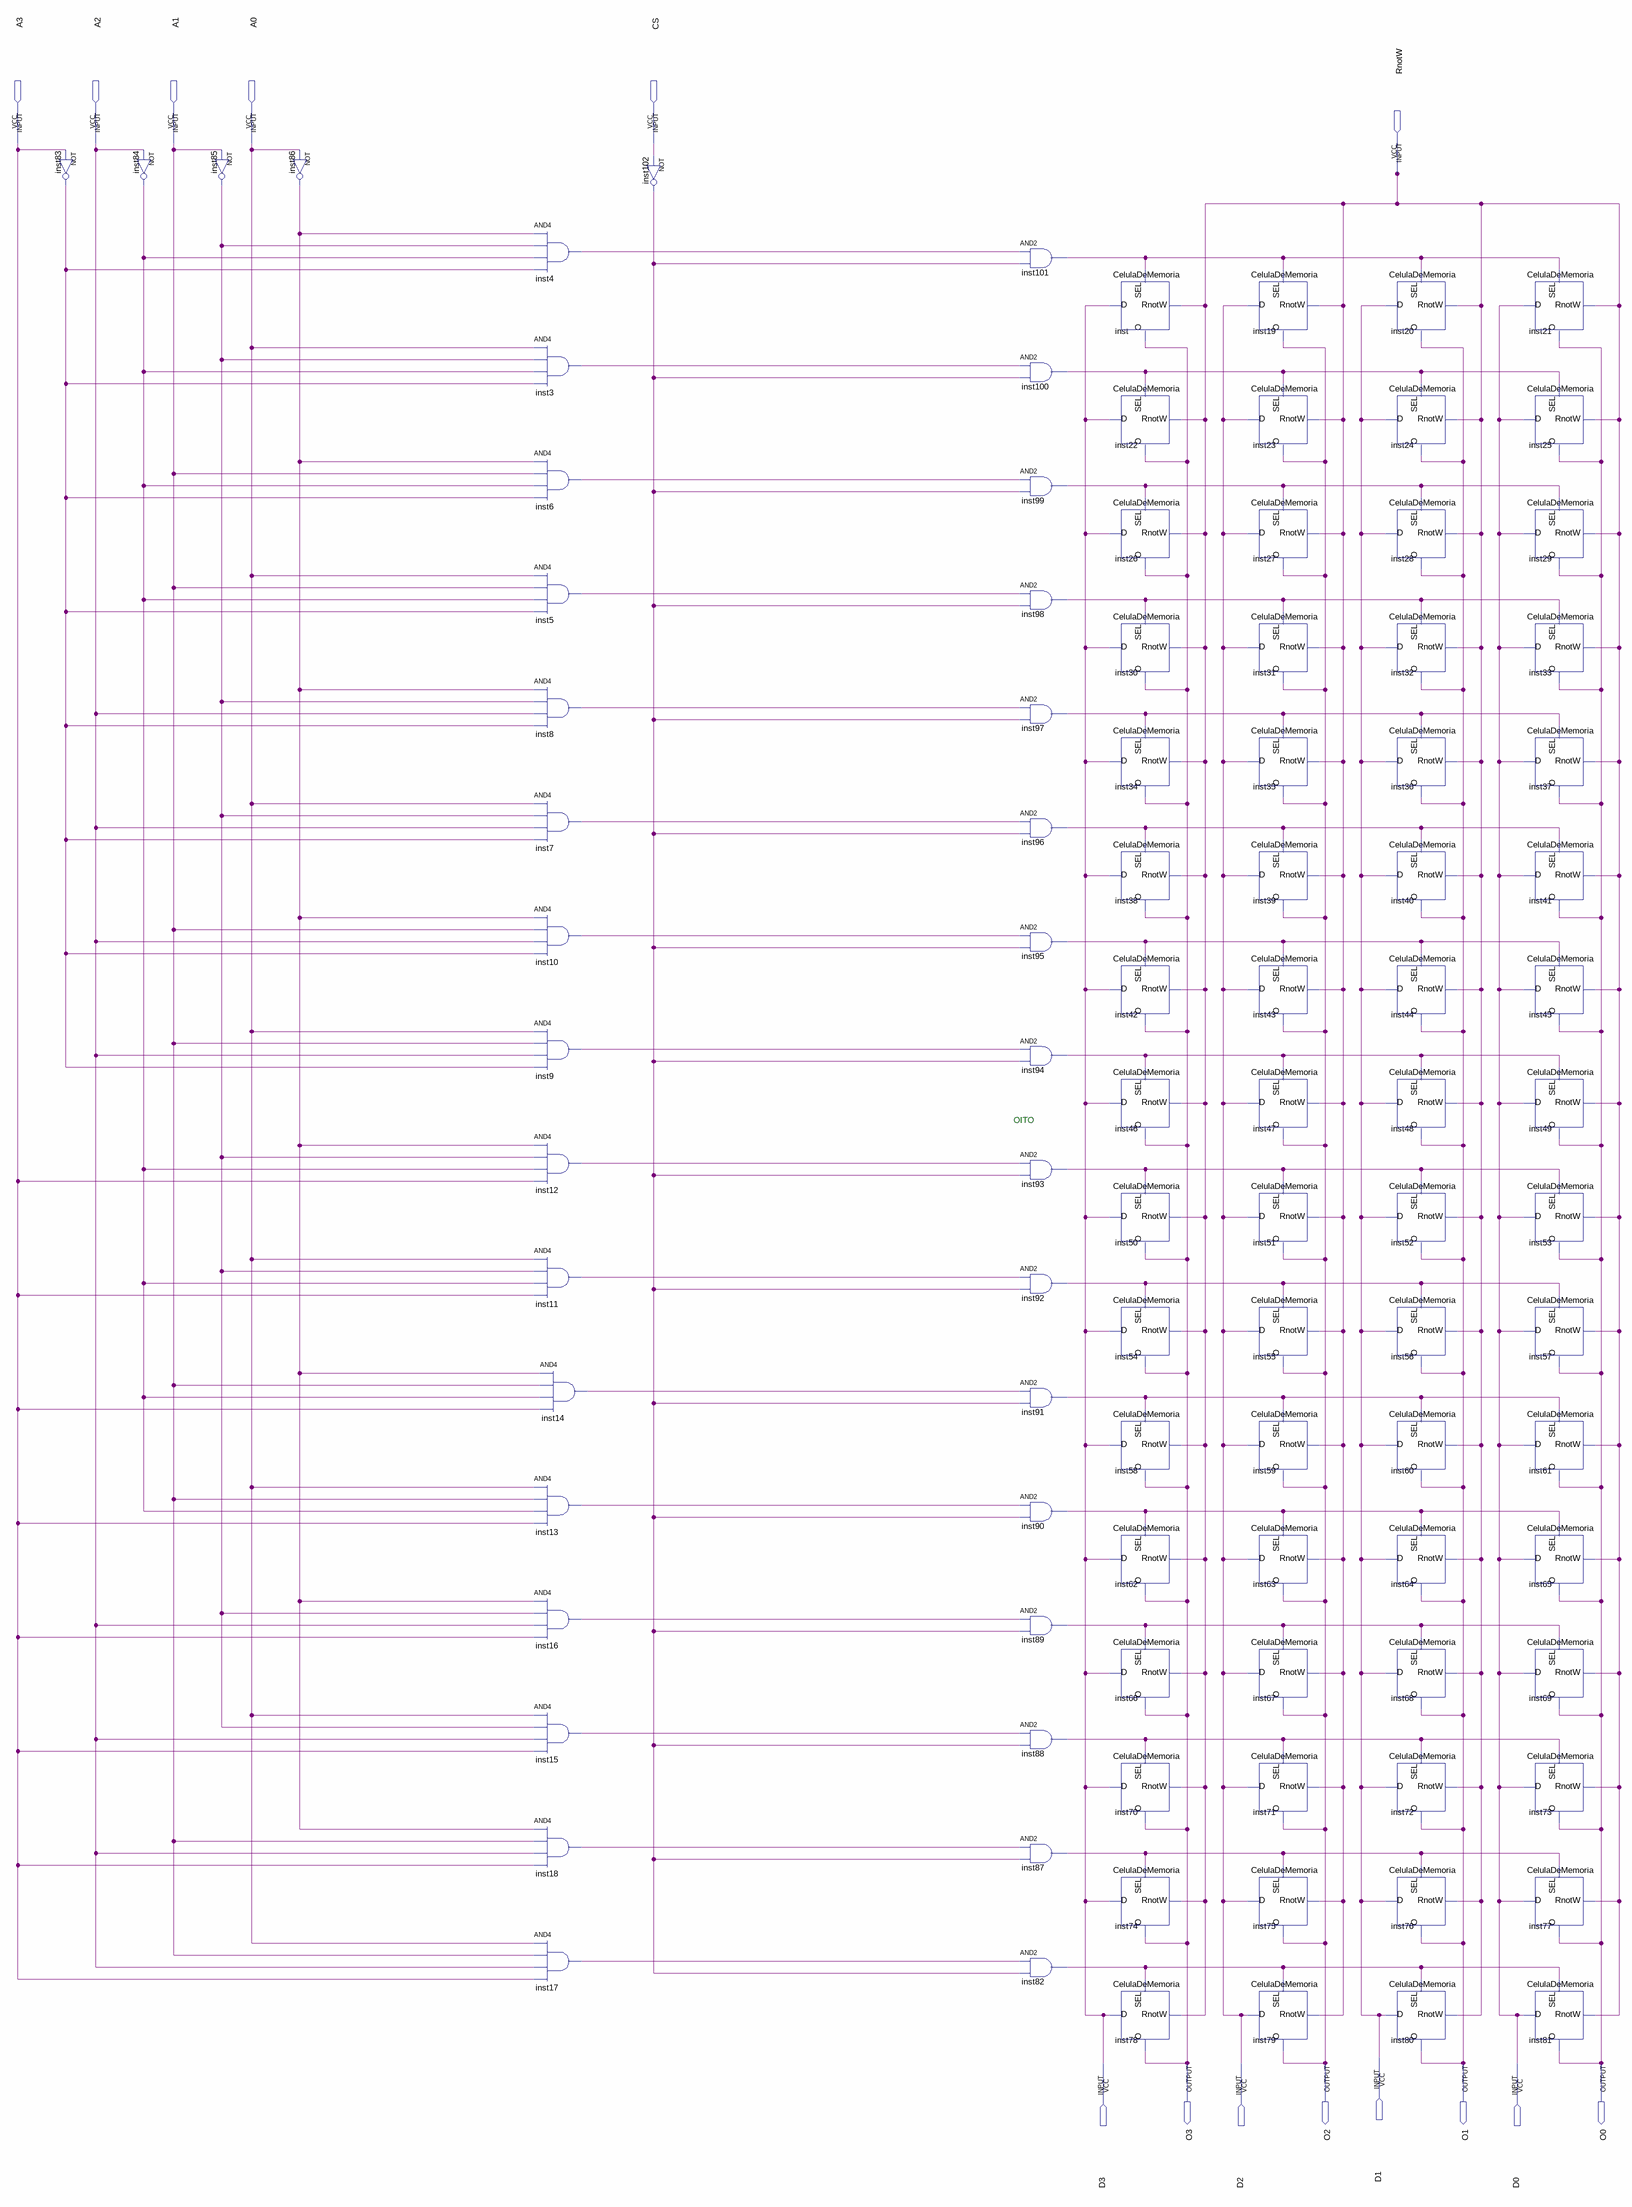
[diagram p0: schematic sheet]
// Quartus schematic CI74189RAM.bdf as structural Verilog: 101 symbols, 14 pins
module CI74189RAM (
  input  A3,
  input  A2,
  input  A1,
  input  A0,
  input  CS,
  input  RnotW,
  input  D1,
  input  D3,
  input  D2,
  input  D0,
  output O3,
  output O2,
  output O1,
  output O0
);

  wire inst3_out, inst4_out, inst5_out, inst6_out, inst7_out, inst8_out, inst9_out, inst10_out, inst11_out,
       inst12_out, inst13_out, inst14_out, inst15_out, inst16_out, inst17_out, inst18_out, inst82_out,
       inst83_out, inst84_out, inst85_out, inst86_out, inst87_out, inst88_out, inst89_out, inst90_out,
       inst91_out, inst92_out, inst93_out, inst94_out, inst95_out, inst96_out, inst97_out, inst98_out,
       inst99_out, inst100_out, inst101_out, inst102_out;

  not inst83 (inst83_out, A3);
  not inst84 (inst84_out, A2);
  not inst85 (inst85_out, A1);
  not inst86 (inst86_out, A0);
  and inst4 (inst4_out, inst86_out, inst85_out, inst84_out, inst83_out);
  and inst3 (inst3_out, A0, inst85_out, inst84_out, inst83_out);
  and inst6 (inst6_out, inst86_out, A1, inst84_out, inst83_out);
  and inst5 (inst5_out, A0, A1, inst84_out, inst83_out);
  and inst8 (inst8_out, inst86_out, inst85_out, A2, inst83_out);
  and inst7 (inst7_out, A0, inst85_out, A2, inst83_out);
  and inst10 (inst10_out, inst86_out, A1, A2, inst83_out);
  and inst9 (inst9_out, A0, A1, A2, inst83_out);
  and inst12 (inst12_out, inst86_out, inst85_out, inst84_out, A3);
  and inst11 (inst11_out, A0, inst85_out, inst84_out, A3);
  and inst14 (inst14_out, inst86_out, A1, inst84_out, A3);
  and inst13 (inst13_out, A0, A1, inst84_out, A3);
  and inst16 (inst16_out, inst86_out, inst85_out, A2, A3);
  and inst15 (inst15_out, A0, inst85_out, A2, A3);
  and inst18 (inst18_out, inst86_out, A1, A2, A3);
  and inst17 (inst17_out, A0, A1, A2, A3);
  not inst102 (inst102_out, CS);
  and inst101 (inst101_out, inst4_out, inst102_out);
  and inst100 (inst100_out, inst3_out, inst102_out);
  and inst99 (inst99_out, inst6_out, inst102_out);
  and inst98 (inst98_out, inst5_out, inst102_out);
  and inst97 (inst97_out, inst8_out, inst102_out);
  and inst96 (inst96_out, inst7_out, inst102_out);
  and inst95 (inst95_out, inst10_out, inst102_out);
  and inst94 (inst94_out, inst9_out, inst102_out);
  and inst93 (inst93_out, inst12_out, inst102_out);
  and inst92 (inst92_out, inst11_out, inst102_out);
  and inst91 (inst91_out, inst14_out, inst102_out);
  and inst90 (inst90_out, inst13_out, inst102_out);
  and inst89 (inst89_out, inst16_out, inst102_out);
  and inst88 (inst88_out, inst15_out, inst102_out);
  and inst87 (inst87_out, inst18_out, inst102_out);
  and inst82 (inst82_out, inst17_out, inst102_out);
  CelulaDeMemoria inst (.RnotW(RnotW), .SEL(inst101_out), .D(D3), .O(O3));
  CelulaDeMemoria inst22 (.RnotW(RnotW), .SEL(inst100_out), .D(D3), .O(O3));
  CelulaDeMemoria inst26 (.RnotW(RnotW), .SEL(inst99_out), .D(D3), .O(O3));
  CelulaDeMemoria inst30 (.RnotW(RnotW), .SEL(inst98_out), .D(D3), .O(O3));
  CelulaDeMemoria inst34 (.RnotW(RnotW), .SEL(inst97_out), .D(D3), .O(O3));
  CelulaDeMemoria inst38 (.RnotW(RnotW), .SEL(inst96_out), .D(D3), .O(O3));
  CelulaDeMemoria inst42 (.RnotW(RnotW), .SEL(inst95_out), .D(D3), .O(O3));
  CelulaDeMemoria inst46 (.RnotW(RnotW), .SEL(inst94_out), .D(D3), .O(O3));
  CelulaDeMemoria inst50 (.RnotW(RnotW), .SEL(inst93_out), .D(D3), .O(O3));
  CelulaDeMemoria inst54 (.RnotW(RnotW), .SEL(inst92_out), .D(D3), .O(O3));
  CelulaDeMemoria inst58 (.RnotW(RnotW), .SEL(inst91_out), .D(D3), .O(O3));
  CelulaDeMemoria inst62 (.RnotW(RnotW), .SEL(inst90_out), .D(D3), .O(O3));
  CelulaDeMemoria inst66 (.RnotW(RnotW), .SEL(inst89_out), .D(D3), .O(O3));
  CelulaDeMemoria inst70 (.RnotW(RnotW), .SEL(inst88_out), .D(D3), .O(O3));
  CelulaDeMemoria inst74 (.RnotW(RnotW), .SEL(inst87_out), .D(D3), .O(O3));
  CelulaDeMemoria inst78 (.RnotW(RnotW), .SEL(inst82_out), .D(D3), .O(O3));
  CelulaDeMemoria inst19 (.RnotW(RnotW), .SEL(inst101_out), .D(D2), .O(O2));
  CelulaDeMemoria inst23 (.RnotW(RnotW), .SEL(inst100_out), .D(D2), .O(O2));
  CelulaDeMemoria inst27 (.RnotW(RnotW), .SEL(inst99_out), .D(D2), .O(O2));
  CelulaDeMemoria inst31 (.RnotW(RnotW), .SEL(inst98_out), .D(D2), .O(O2));
  CelulaDeMemoria inst35 (.RnotW(RnotW), .SEL(inst97_out), .D(D2), .O(O2));
  CelulaDeMemoria inst39 (.RnotW(RnotW), .SEL(inst96_out), .D(D2), .O(O2));
  CelulaDeMemoria inst43 (.RnotW(RnotW), .SEL(inst95_out), .D(D2), .O(O2));
  CelulaDeMemoria inst47 (.RnotW(RnotW), .SEL(inst94_out), .D(D2), .O(O2));
  CelulaDeMemoria inst51 (.RnotW(RnotW), .SEL(inst93_out), .D(D2), .O(O2));
  CelulaDeMemoria inst55 (.RnotW(RnotW), .SEL(inst92_out), .D(D2), .O(O2));
  CelulaDeMemoria inst59 (.RnotW(RnotW), .SEL(inst91_out), .D(D2), .O(O2));
  CelulaDeMemoria inst63 (.RnotW(RnotW), .SEL(inst90_out), .D(D2), .O(O2));
  CelulaDeMemoria inst67 (.RnotW(RnotW), .SEL(inst89_out), .D(D2), .O(O2));
  CelulaDeMemoria inst71 (.RnotW(RnotW), .SEL(inst88_out), .D(D2), .O(O2));
  CelulaDeMemoria inst75 (.RnotW(RnotW), .SEL(inst87_out), .D(D2), .O(O2));
  CelulaDeMemoria inst79 (.RnotW(RnotW), .SEL(inst82_out), .D(D2), .O(O2));
  CelulaDeMemoria inst20 (.RnotW(RnotW), .SEL(inst101_out), .D(D1), .O(O1));
  CelulaDeMemoria inst24 (.RnotW(RnotW), .SEL(inst100_out), .D(D1), .O(O1));
  CelulaDeMemoria inst28 (.RnotW(RnotW), .SEL(inst99_out), .D(D1), .O(O1));
  CelulaDeMemoria inst32 (.RnotW(RnotW), .SEL(inst98_out), .D(D1), .O(O1));
  CelulaDeMemoria inst36 (.RnotW(RnotW), .SEL(inst97_out), .D(D1), .O(O1));
  CelulaDeMemoria inst40 (.RnotW(RnotW), .SEL(inst96_out), .D(D1), .O(O1));
  CelulaDeMemoria inst44 (.RnotW(RnotW), .SEL(inst95_out), .D(D1), .O(O1));
  CelulaDeMemoria inst48 (.RnotW(RnotW), .SEL(inst94_out), .D(D1), .O(O1));
  CelulaDeMemoria inst52 (.RnotW(RnotW), .SEL(inst93_out), .D(D1), .O(O1));
  CelulaDeMemoria inst56 (.RnotW(RnotW), .SEL(inst92_out), .D(D1), .O(O1));
  CelulaDeMemoria inst60 (.RnotW(RnotW), .SEL(inst91_out), .D(D1), .O(O1));
  CelulaDeMemoria inst64 (.RnotW(RnotW), .SEL(inst90_out), .D(D1), .O(O1));
  CelulaDeMemoria inst68 (.RnotW(RnotW), .SEL(inst89_out), .D(D1), .O(O1));
  CelulaDeMemoria inst72 (.RnotW(RnotW), .SEL(inst88_out), .D(D1), .O(O1));
  CelulaDeMemoria inst76 (.RnotW(RnotW), .SEL(inst87_out), .D(D1), .O(O1));
  CelulaDeMemoria inst80 (.RnotW(RnotW), .SEL(inst82_out), .D(D1), .O(O1));
  CelulaDeMemoria inst21 (.RnotW(RnotW), .SEL(inst101_out), .D(D0), .O(O0));
  CelulaDeMemoria inst25 (.RnotW(RnotW), .SEL(inst100_out), .D(D0), .O(O0));
  CelulaDeMemoria inst29 (.RnotW(RnotW), .SEL(inst99_out), .D(D0), .O(O0));
  CelulaDeMemoria inst33 (.RnotW(RnotW), .SEL(inst98_out), .D(D0), .O(O0));
  CelulaDeMemoria inst37 (.RnotW(RnotW), .SEL(inst97_out), .D(D0), .O(O0));
  CelulaDeMemoria inst41 (.RnotW(RnotW), .SEL(inst96_out), .D(D0), .O(O0));
  CelulaDeMemoria inst45 (.RnotW(RnotW), .SEL(inst95_out), .D(D0), .O(O0));
  CelulaDeMemoria inst49 (.RnotW(RnotW), .SEL(inst94_out), .D(D0), .O(O0));
  CelulaDeMemoria inst53 (.RnotW(RnotW), .SEL(inst93_out), .D(D0), .O(O0));
  CelulaDeMemoria inst57 (.RnotW(RnotW), .SEL(inst92_out), .D(D0), .O(O0));
  CelulaDeMemoria inst61 (.RnotW(RnotW), .SEL(inst91_out), .D(D0), .O(O0));
  CelulaDeMemoria inst65 (.RnotW(RnotW), .SEL(inst90_out), .D(D0), .O(O0));
  CelulaDeMemoria inst69 (.RnotW(RnotW), .SEL(inst89_out), .D(D0), .O(O0));
  CelulaDeMemoria inst73 (.RnotW(RnotW), .SEL(inst88_out), .D(D0), .O(O0));
  CelulaDeMemoria inst77 (.RnotW(RnotW), .SEL(inst87_out), .D(D0), .O(O0));
  CelulaDeMemoria inst81 (.RnotW(RnotW), .SEL(inst82_out), .D(D0), .O(O0));

  // Notes on the sheet:
  //   OITO
endmodule
